# EAGLE design main (EAGLE 8.0.1)
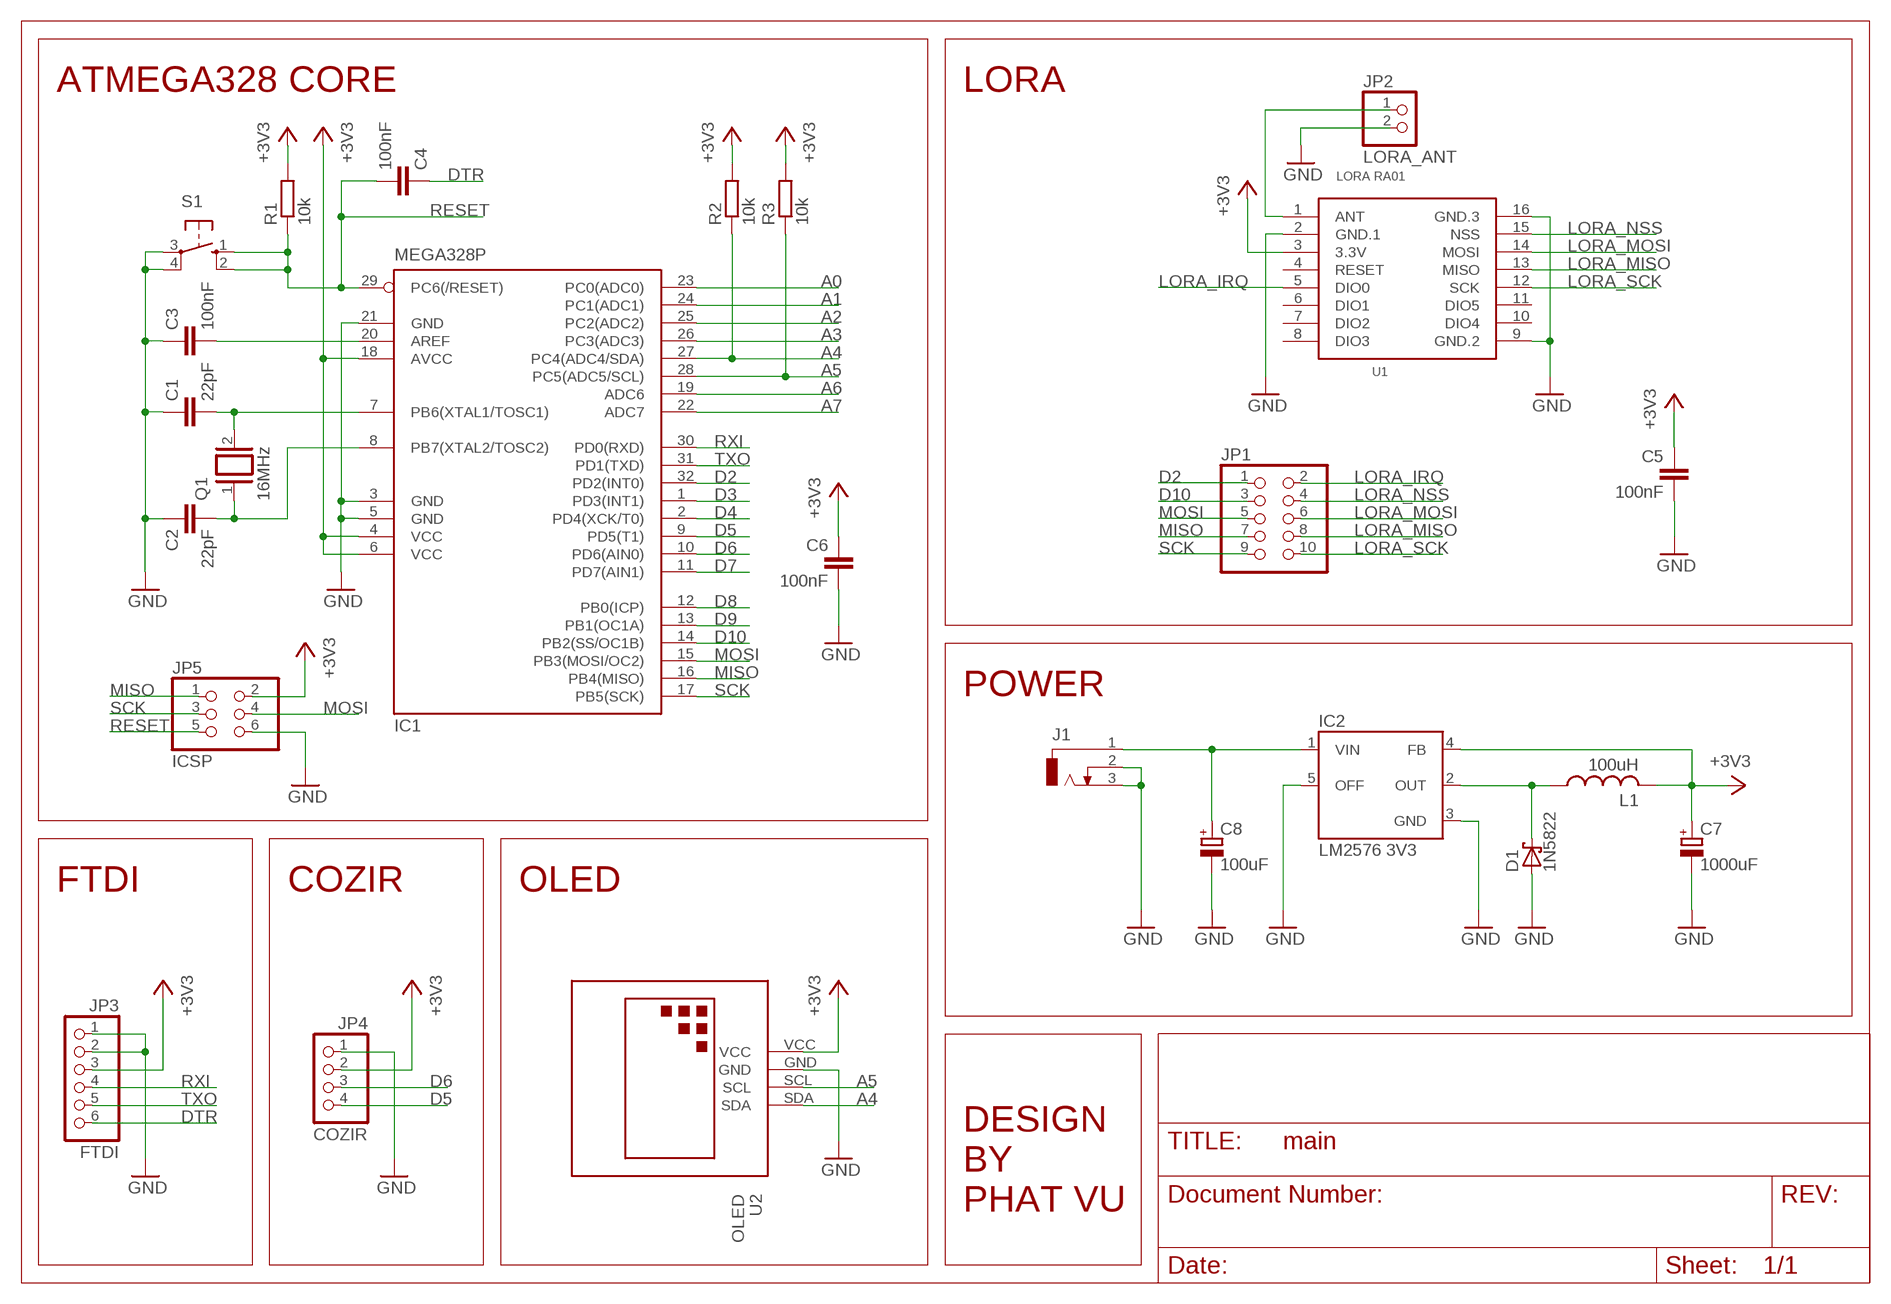
[diagram p0: schematic, sheet 1]

## Parts
C1  22pF  C-EU050-024X044  [C050-024X044]
C2  22pF  C-EU050-024X044  [C050-024X044]
C3  100nF  C-EU050-024X044  [C050-024X044]
C4  100nF  C-EU050-024X044  [C050-024X044]
C5  100nF  C-EU050-024X044  [C050-024X044]
C6  100nF  C-EU050-024X044  [C050-024X044]
C7  1000uF  CPOL-EUE5-13  [E5-13]
C8  100uF  CPOL-EUE5-8.5  [E5-8,5]
D1  1N5822  SCHOTTKY-DIODEDO201T15  [DO201T15]
IC1  MEGA328P  MEGA8-AI  [TQFP32-08]
IC2  LM2576 3V3  LM2576S  [TO263-5]
J1  DCJ0303  [DCJ0303]
JP1  PINHD-2X5  [2X05]
JP2  LORA_ANT  PINHD-1X2  [1X02]
JP3  FTDI  PINHD-1X6  [1X06]
JP4  COZIR  PINHD-1X4  [1X04]
JP5  ICSP  PINHD-2X3  [2X03]
L1  100uH  L-US6000-XXX-RC  [6000-XXXX-RC]
Q1  16MHz  XTAL/S  [QS]
R1  10k  R-EU_0207/10  [0207/10]
R2  10k  R-EU_0207/10  [0207/10]
R3  10k  R-EU_0207/10  [0207/10]
S1  10-XX  [B3F-10XX]
U1  LORA RA01  LORA-RA-01-433MHZ  [LORA-RA1-SMD]
U2  OLED  OLED-096-I2C  [OLED-096-I2C]

## Nets
+3V3: C5.1 C6.1 C7.+ IC1.4(VCC) IC1.6(VCC) IC1.18(AVCC) IC2.4(FB) JP3.3 JP4.2 JP5.2 L1.2 R1.2 R2.2 R3.2 U1.3(3.3V) U2.VCC
A0: IC1.23(PC0(ADC0))
A1: IC1.24(PC1(ADC1))
A2: IC1.25(PC2(ADC2))
A3: IC1.26(PC3(ADC3))
A4: IC1.27(PC4(ADC4/SDA)) R2.1 U2.SDA
A5: IC1.28(PC5(ADC5/SCL)) R3.1 U2.SCL
A6: IC1.19(ADC6)
A7: IC1.22(ADC7)
D2: IC1.32(PD2(INT0)) JP1.1
D3: IC1.1(PD3(INT1))
D4: IC1.2(PD4(XCK/T0))
D5: IC1.9(PD5(T1)) JP4.4
D6: IC1.10(PD6(AIN0)) JP4.3
D7: IC1.11(PD7(AIN1))
D8: IC1.12(PB0(ICP))
D9: IC1.13(PB1(OC1A))
D10: IC1.14(PB2(SS/OC1B)) JP1.3
DTR: C4.1 JP3.6
GND: C1.1 C2.1 C3.1 C5.2 C6.2 C7.- C8.- D1.A IC1.3(GND) IC1.5(GND) IC1.21(GND) IC2.3(GND) IC2.5(OFF) J1.2 J1.3 JP2.2 JP3.1 JP3.2 JP4.1 JP5.6 S1.3(P) S1.4(P1) U1.2(GND.1) U1.9(GND.2) U1.16(GND.3) U2.GND
LORA_IRQ: JP1.2 U1.5(DIO0)
LORA_MISO: JP1.8 U1.13(MISO)
LORA_MOSI: JP1.6 U1.14(MOSI)
LORA_NSS: JP1.4 U1.15(NSS)
LORA_SCK: JP1.10 U1.12(SCK)
MISO: IC1.16(PB4(MISO)) JP1.7 JP5.1
MOSI: IC1.15(PB3(MOSI/OC2)) JP1.5 JP5.4
N$1: JP2.1 U1.1(ANT)
N$5: C1.2 IC1.7(PB6(XTAL1/TOSC1)) Q1.2
N$6: C2.2 IC1.8(PB7(XTAL2/TOSC2)) Q1.1
N$8: C3.2 IC1.20(AREF)
N$9: C8.+ IC2.1(VIN) J1.1
N$10: D1.C IC2.2(OUT) L1.1
RESET: C4.2 IC1.29(PC6(/RESET)) JP5.5 R1.1 S1.1(S) S1.2(S1)
RXI: IC1.30(PD0(RXD)) JP3.4
SCK: IC1.17(PB5(SCK)) JP1.9 JP5.3
TXO: IC1.31(PD1(TXD)) JP3.5
Unconnected: U1.4(RESET) U1.6(DIO1) U1.7(DIO2) U1.8(DIO3) U1.10(DIO4) U1.11(DIO5)

## Notes on the sheet
- ATMEGA328 CORE | LORA
- POWER
- FTDI | COZIR | OLED
- DESIGN
  BY
  PHAT VU

## Library data of the parts
C1-C6 = rcl:C-EU: CAPACITOR, European symbol
C7 C8 = rcl:CPOL-EU: POLARIZED CAPACITOR, European symbol
D1 = diode:SCHOTTKY-DIODE: Schottky Diode
IC1 = atmel:MEGA8: MICROCONTROLLER 8 Kbytes FLASH, 1 kbytes SRAM, 512 bytes EEPROM, USART, 6-channel 10 bit ADC, 2-channel 8 bit ADC Pin compatible with Atmega48, ATMega88, ATMega168 Source: avr.lbr; MPN: ATMEGA8-16AU; OC_FARNELL: 9171371; OC_NEWARK: 73M8863
IC2 = lm2576:LM2576: National Semiconductor <http://www.national.com> 3.0A "Simple Switcher"(c) 52kHz, Vout 1.23-37V (HV: 57V), Vin 40V (HV: 60V), 50µA standby current
J1 = con-jack:DCJ0303: DC POWER JACK Source: DCJ0303.pdf; OC_FARNELL: unknown; OC_NEWARK: unknown
JP1 = pinhead:PINHD-2X5: PIN HEADER
JP2 = pinhead:PINHD-1X2: PIN HEADER
JP3 = pinhead:PINHD-1X6: PIN HEADER
JP4 = pinhead:PINHD-1X4: PIN HEADER
JP5 = pinhead:PINHD-2X3: PIN HEADER
L1 = rcl:L-US: INDUCTOR, American symbol
Q1 = special:XTAL/S: CRYSTAL
R1-R3 = rcl:R-EU_: RESISTOR, European symbol
S1 = switch-omron:10-XX: OMRON SWITCH; MPN: B3F-1000; OC_FARNELL: 176432; OC_NEWARK: 36M3542
U1 = lora:LORA-RA-01-433MHZ: 433 MHz Lora Ra-01 Radio Transceiver Module based on SX1278 chip.
U2 = oled:OLED-096-I2C

## Board
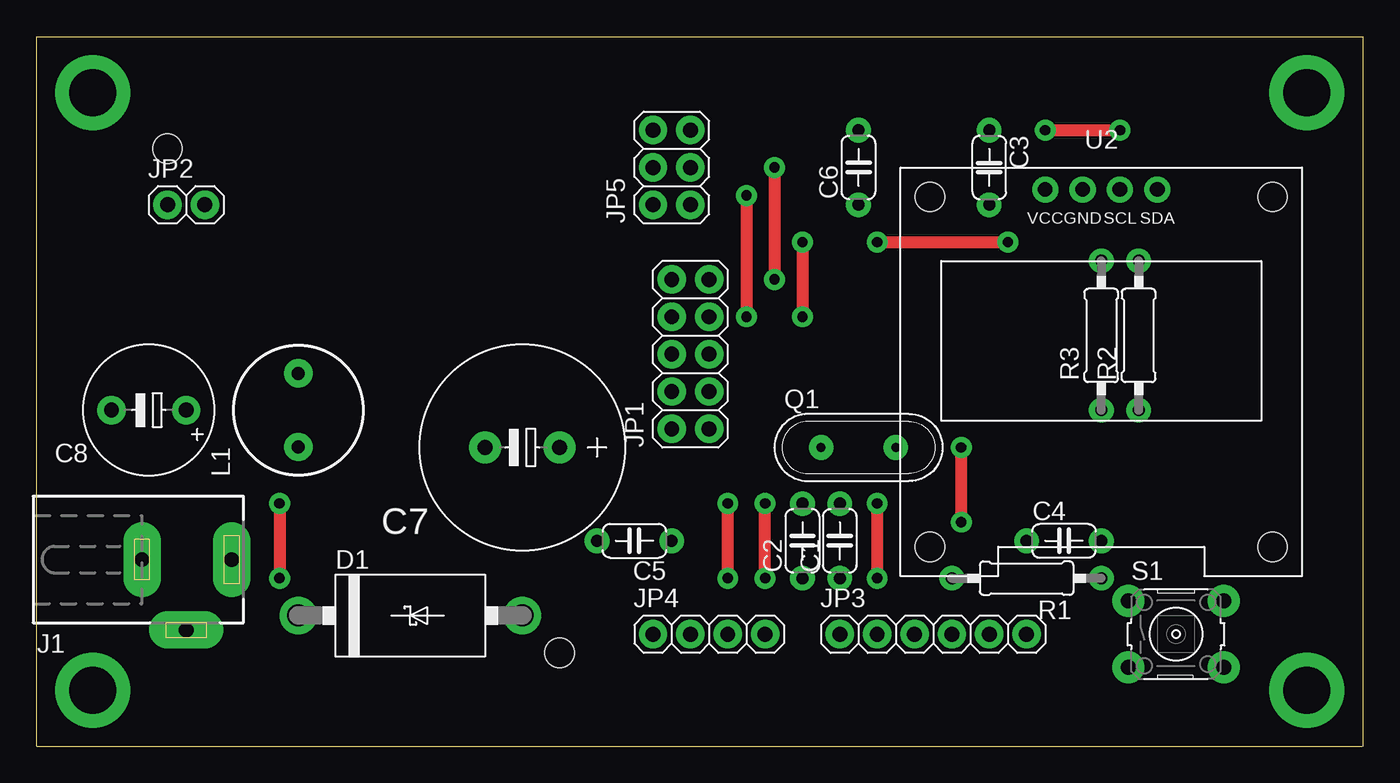
[diagram p1: board, top side]
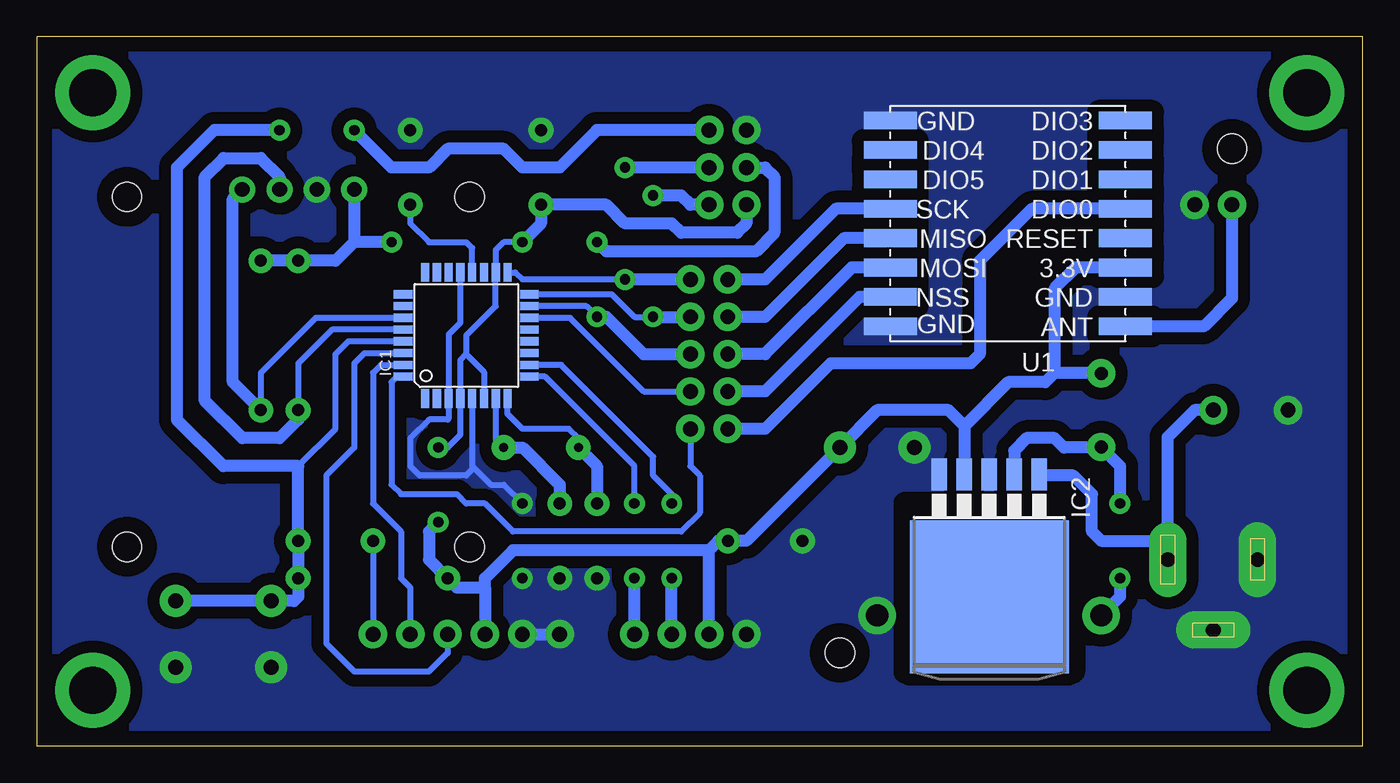
[diagram p2: board, bottom side, seen from below]

Size 90.17 x 48.26 mm. Coordinates in mm from the lower left corner, seen from the top.
Outline: 90.15,0 0,0 0,48.26 90.17,48.26 90.17,0
Copper layers (1*16): Top 0.035mm / dielectric 1.5mm / Bottom 0.035mm
Design rules "default": minimum track width 10mil, minimum drill 24mil, track to track 8mil, track to pad 8mil, pad to pad 8mil, via to via 8mil, smd to smd 8mil, copper to edge 40mil, drill to drill 8mil, minimum pad ring 10mil, minimum via ring 8mil, stop-mask expansion 4mil, vias tented up to drill 0mil, thermal gap 10mil
Holes 2 mm at 8.89,40.64 35.56,6.35
bRestrict: area 58.4,25.4 to 63.5,30.5; area 19.7,5.1 to 31.1,16.5

### Footprints (pad centres in the part's own frame; a part is rotated, then mirrored left to right if it is on the bottom)
C050-024X044 = drill 0.813 pad 1.676: 1 -2.54,0; 2 2.54,0
E5-13 = drill 1.016 pad 2.184: + -2.54,0; - 2.54,0
E5-8,5 = drill 1.016 pad 1.93: + -2.54,0; - 2.54,0
DO201T15 = drill 1.499 pad 2.54: A 7.62,0; C -7.62,0
TQFP32-08 = smd 1.27 x 0.559: 1 -4.293,2.8; 2 -4.293,2; 3 -4.293,1.2; 4 -4.293,0.4; 5 -4.293,-0.4; 6 -4.293,-1.2; 7 -4.293,-2; 8 -4.293,-2.8; 17 4.293,-2.8; 18 4.293,-2; 19 4.293,-1.2; 20 4.293,-0.4; 21 4.293,0.4; 22 4.293,1.2; 23 4.293,2; 24 4.293,2.8 | smd 0.559 x 1.27: 9 -2.8,-4.293; 10 -2,-4.293; 11 -1.2,-4.293; 12 -0.4,-4.293; 13 0.4,-4.293; 14 1.2,-4.293; 15 2,-4.293; 16 2.8,-4.293; 25 2.8,4.293; 26 2,4.293; 27 1.2,4.293; 28 0.4,4.293; 29 -0.4,4.293; 30 -1.2,4.293; 31 -2,4.293; 32 -2.8,4.293
TO263-5 = smd 1.067 x 2.159: 1 -3.404,-5.791; 2 -1.702,-5.791; 3 0,-5.791; 4 1.702,-5.791; 5 3.404,-5.791 | smd 10.8 x 10.41: 6 0,2.54
DCJ0303 = drill 1 pad 2.54 long: 1 0,3.1; 2 4.8,0; 3 0,-3
2X05 = drill 1.016 pad 1.93: 1 -5.08,-1.27; 2 -5.08,1.27; 3 -2.54,-1.27; 4 -2.54,1.27; 5 0,-1.27; 6 0,1.27; 7 2.54,-1.27; 8 2.54,1.27; 9 5.08,-1.27; 10 5.08,1.27
1X02 = drill 1.016 pad 1.93: 1 -1.27,0; 2 1.27,0
1X06 = drill 1.016 pad 1.93: 1 -6.35,0; 2 -3.81,0; 3 -1.27,0; 4 1.27,0; 5 3.81,0; 6 6.35,0
1X04 = drill 1.016 pad 1.93: 1 -3.81,0; 2 -1.27,0; 3 1.27,0; 4 3.81,0
2X03 = drill 1.016 pad 1.93: 1 -2.54,-1.27; 2 -2.54,1.27; 3 0,-1.27; 4 0,1.27; 5 2.54,-1.27; 6 2.54,1.27
6000-XXXX-RC = drill 0.9 pad 1.93: 1 -2.5,0; 2 2.5,0
QS = drill 0.61 pad 1.676: 1 -2.54,0; 2 2.54,0
0207/10 = drill 0.813 pad 1.676: 1 -5.08,0; 2 5.08,0
B3F-10XX = drill 1.016 pad 2.184: 1 -3.251,2.261; 2 3.251,2.261; 3 -3.251,-2.261; 4 3.251,-2.261
LORA-RA1-SMD = smd 3.6 x 1.2: 1 -8,7; 2 -8,5; 3 -8,3; 4 -8,1; 5 -8,-1; 6 -8,-3; 7 -8,-5; 8 -8,-7; 9 8,-7; 10 8,-5; 11 8,-3; 12 8,-1; 13 8,1; 14 8,3; 15 8,5; 16 8,7
OLED-096-I2C = drill 1 pad 1.778: GND -1.27,9.93; SCL 1.27,9.93; SDA 3.81,9.93; VCC -3.81,9.93 | hole 2: -11.65,9.43; 11.65,9.43; -11.65,-14.37; 11.65,-14.37

### Placement (x,y rotation side)
C1  54.61,13.97 90 top
C2  52.07,13.97 90 top
C3  64.77,39.37 270 top
C4  69.85,13.97 0 top
C5  40.64,13.97 180 top
C6  55.88,39.37 90 top
C7  33.02,20.32 180 top
C8  7.62,22.86 180 top
D1  25.4,8.89 0 top
IC1  60.96,27.94 90 bottom
IC2  25.4,12.7 180 bottom
J1  10.16,12.7 270 top
JP1  44.45,26.67 90 top
JP2  10.16,36.83 0 top
JP3  60.96,7.62 0 top
JP4  45.72,7.62 0 top
JP5  43.18,39.37 90 top
L1  17.78,22.86 90 top
Q1  55.88,20.32 0 top
R1  67.31,11.43 180 top
R2  74.93,27.94 90 top
R3  72.39,27.94 90 top
S1  77.47,7.62 0 top
U1  24.13,35.56 180 bottom
U2  72.39,27.94 0 top

### Tracks (layer width: path | path; a pad name or v marks a point on that pad's centre or on a via)
+3V3  (via drill 0.7 pad 1.42)
  Top 0.813: v62.87,15.24 v62.87,20.32 | v57.15,34.29 v66.04,34.29
  Bottom 0.406: 59.69,23.58 IC1.6 59.76,25.47 60.96,26.67 | 60.96,26.67 60.96,27.94 58.96,29.94 IC1.18 58.96,33.75 58.42,34.29 v57.15,34.29 | 60.96,26.67 61.36,26.27 IC1.4 61.36,21.19 62.23,20.32 v62.87,20.32
  Bottom 0.813: R2.2 R3.2 69.85,33.02 68.58,34.29 | v57.15,34.29 55.88,35.56 C6.1 51.44,36.83 50.16,35.56 46.99,35.56 46.35,34.92 42.55,34.92 41.91,35.56 JP5.2 | U1.3 19.51,32.56 20.95,31.11 20.95,25.4 | v66.04,34.29 68.58,34.29 | U2.VCC 68.58,34.29 | v62.87,15.24 63.5,14.61 63.5,12.7 R1.2 61.59,10.79 59.69,10.79 | 44.45,13.34 57.78,13.34 59.69,11.43 59.69,10.79 | 44.45,13.34 43.81,13.97 C5.1 41.91,13.97 C7.+ 33.02,22.86 28.17,22.86 27.1,21.79 | 27.1,21.79 IC2.4 | L1.2 17.82,25.4 20.95,25.4 | 59.69,10.79 JP3.3 | JP4.2 44.45,13.34 | 20.95,25.4 21.59,24.77 24.13,24.77 27.1,21.79
A4
  Bottom 0.406: IC1.27 71.19,29.14 74.93,25.4 R2.1
  Bottom 0.813: U2.SDA 76.83,37.23 76.83,24.77 R2.1
A5
  Bottom 0.406: IC1.28 70.08,28.34 72.39,26.04 R3.1
  Bottom 0.813: R3.1 72.39,22.23 73.66,20.95 76.2,20.95 78.74,23.5 78.74,38.73 77.47,40.01 74.93,40.01 73.66,38.73 U2.SCL
D2
  Bottom 0.406: IC1.32 65.67,25.14 66.04,24.77 66.04,17.78 65.41,17.14 61.59,17.14 60.96,16.51 59.69,16.51 57.78,14.61 46.35,14.61 45.09,15.88 45.09,18.41 45.72,19.05 JP1.1
D5  (via drill 0.7 pad 1.42)
  Top 0.813: v49.53,11.43 v49.53,16.51
  Bottom 0.406: IC1.9 55.62,25.14 49.53,19.05 v49.53,16.51
  Bottom 0.813: JP4.4 v49.53,11.43
D6  (via drill 0.7 pad 1.42)
  Top 0.813: v46.99,11.43 v46.99,16.51
  Bottom 0.406: v46.99,16.51 46.99,17.14 48.26,18.41 48.26,19.68 54.52,25.94 IC1.10
  Bottom 0.813: JP4.3 v46.99,11.43
D10
  Bottom 0.406: IC1.14 53.91,29.14 48.9,24.13 JP1.3
DTR
  Bottom 0.406: C4.1 JP3.6
GND  (via drill 0.7 pad 1.42)
  Top 0.813: v57.15,16.51 v57.15,11.43
  Bottom 0.406: IC1.21 61.36,28.81 62.16,28.01 IC1.3 | IC1.5 60.56,19.05 | 60.56,19.05 60.56,18.82 60.96,18.41 64.14,18.41 64.77,19.05 64.77,20.95 63.5,22.23 62.23,22.23 62.16,22.3 IC1.3 | 62.16,22.93 IC1.3 | 60.56,19.05 59.29,17.78 58.42,17.78 v57.15,16.51
  Bottom 0.61: IC2.3 25.4,17.78
  Bottom 0.813: JP3.2 JP3.1 | 7.16,14.43 J1.3
  pour Bottom (isolate 0.813, no thermals): 0,48.26 90.17,48.26 90.17,0 0,0
LORA_IRQ
  Bottom 0.813: U1.5 22.5,36.56 26.04,33.02 26.04,26.67 26.67,26.04 36.2,26.04 40.64,21.59 JP1.2
LORA_MISO
  Bottom 0.813: U1.13 35.29,34.56 40.64,29.21 JP1.8
LORA_MOSI
  Bottom 0.813: U1.14 34.75,32.56 40.64,26.67 JP1.6
LORA_NSS
  Bottom 0.813: U1.15 34.21,30.56 40.64,24.13 JP1.4
LORA_SCK
  Bottom 0.813: U1.12 35.83,36.56 40.64,31.75 JP1.10
MISO  (via drill 0.7 pad 1.42)
  Top 0.813: v48.26,37.47 v48.26,29.21
  Bottom 0.406: v48.26,29.21 49.53,29.21 51.06,30.74 IC1.16
  Bottom 0.813: JP5.1 45.72,36.83 46.35,37.47 v48.26,37.47 | v48.26,29.21 JP1.7
MOSI  (via drill 0.7 pad 1.42)
  Top 0.813: v52.07,34.29 v52.07,29.21
  Bottom 0.406: v52.07,29.21 52.8,29.94 IC1.15
  Bottom 0.813: v52.07,34.29 51.44,33.66 41.27,33.66 40.01,34.92 40.01,38.73 40.64,39.37 JP5.4 | v52.07,29.21 51.44,29.21 48.9,26.67 JP1.5
N$1
  Bottom 0.813: JP2.1 8.89,30.48 10.81,28.56 U1.1
N$2  (via drill 3.2 pad 5.08)
  other vias: 3.81,44.45
N$3  (via drill 3.2 pad 5.08)
  other vias: 86.36,44.45
N$4  (via drill 3.2 pad 5.08)
  other vias: 86.36,3.81
N$5
  Bottom 0.406: IC1.7 58.96,20.86 Q1.2
  Bottom 0.813: Q1.2 57.15,20.32 54.61,17.78 C1.2
N$6
  Bottom 0.406: Q1.1 53.34,20.95 53.98,21.59 57.15,21.59 58.16,22.6 IC1.8
  Bottom 0.813: Q1.1 52.07,19.05 C2.2
N$7  (via drill 3.2 pad 5.08)
  other vias: 3.81,3.81
N$8
  Bottom 0.406: IC1.20 60.56,33.89 60.96,34.29 63.5,34.29 64.77,35.56 C3.2
N$9
  Bottom 0.406: 21.92,18.41 IC2.1
  Bottom 0.813: C8.+ 11.43,22.86 13.26,21.03 J1.1 13.26,13.26 13.97,13.97 17.78,13.97 18.41,14.61 18.41,17.14 19.68,18.41 21.92,18.41
N$10  (via drill 0.7 pad 1.42)
  Top 0.813: v16.51,16.51 v16.51,11.43
  Bottom 0.406: 17.82,20.32 L1.1 17.78,20.32
  Bottom 0.813: 17.82,20.32 20.32,20.32 20.95,20.95 22.86,20.95 23.7,20.12 IC2.2 | 17.78,20.32 16.51,19.05 v16.51,16.51 | v16.51,11.43 16.51,10.16 D1.C
RESET  (via drill 0.7 pad 1.42)
  Top 0.813: v68.58,41.91 v73.66,41.91
  Bottom 0.406: IC1.29 68.98,27.54 69.85,26.67 69.85,21.59 72.39,19.05
  Bottom 0.813: v68.58,41.91 66.04,39.37 63.5,39.37 62.23,40.64 58.42,40.64 57.15,39.37 54.61,39.37 52.07,41.91 JP5.5 | v73.66,41.91 78.11,41.91 80.64,39.37 80.64,22.23 77.47,19.05 72.39,19.05 C4.2 R1.1 72.39,10.16 72.67,9.88 S1.1 S1.2
RXI
  Bottom 0.406: JP3.4 62.23,6.35 63.5,5.08 68.58,5.08 70.48,6.99 70.48,18.41 68.58,20.32 68.58,26.04 67.88,26.74 IC1.30
SCK  (via drill 0.7 pad 1.42)
  Top 0.813: v50.16,39.37 v50.16,31.75
  Bottom 0.406: IC1.17 57.63,32.23 57.15,31.75 v50.16,31.75
  Bottom 0.813: JP5.3 v50.16,39.37 | JP1.9 v50.16,31.75
TXO
  Bottom 0.406: IC1.31 66.77,25.94 67.31,25.4 67.31,16.51 65.41,14.61 65.41,11.43 64.77,10.79 JP3.5